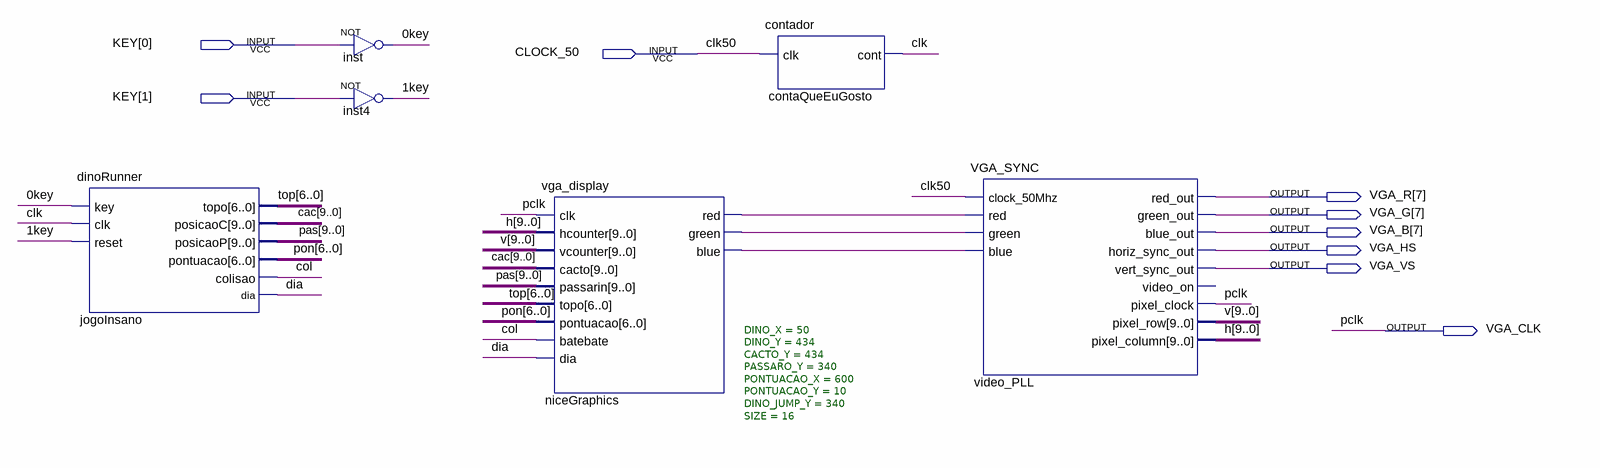
[diagram p0: schematic sheet]
// Quartus schematic dinossauroRawr.bdf as structural Verilog: 6 symbols, 9 pins
module dinossauroRawr (
  input  [1:0] KEY,
  input  CLOCK_50,
  output [7:7] VGA_R,
  output [7:7] VGA_G,
  output [7:7] VGA_B,
  output VGA_HS,
  output VGA_VS,
  output VGA_CLK
);

  wire \0key , \1key , clk, col, dia, niceGraphics_blue, niceGraphics_green, niceGraphics_red;
  wire [6:0] pon, top;
  wire [9:0] cac, h, pas, v;

  dinoRunner jogoInsano (
    .key(\0key ), .clk(clk), .reset(\1key ), .topo(top), .posicaoC(cac), .posicaoP(pas), .pontuacao(pon),
    .colisao(col), .dia(dia));
  not inst (\0key , KEY[0]);
  not inst4 (\1key , KEY[1]);
  vga_display #(.DINO_X(50), .DINO_Y(434), .CACTO_Y(434), .PASSARO_Y(340), .PONTUACAO_X(600), .PONTUACAO_Y(10), .DINO_JUMP_Y(340), .SIZE(16)) niceGraphics (
    .clk(VGA_CLK), .hcounter(h), .vcounter(v), .cacto(cac), .passarin(pas), .topo(top), .pontuacao(pon),
    .batebate(col), .dia(dia), .red(niceGraphics_red), .green(niceGraphics_green), .blue(niceGraphics_blue));
  contador contaQueEuGosto (.clk(CLOCK_50), .cont(clk));
  VGA_SYNC video_PLL (
    .clock_50Mhz(CLOCK_50), .red(niceGraphics_red), .green(niceGraphics_green), .blue(niceGraphics_blue),
    .red_out(VGA_R[7]), .green_out(VGA_G[7]), .blue_out(VGA_B[7]), .horiz_sync_out(VGA_HS),
    .vert_sync_out(VGA_VS), .pixel_clock(VGA_CLK), .pixel_row(v), .pixel_column(h));  // open: video_on

  // Other names for the same wires on the sheet: clk50 = CLOCK_50; pclk = VGA_CLK
endmodule
